# EAGLE design flossjtag (EAGLE 7.4.0)
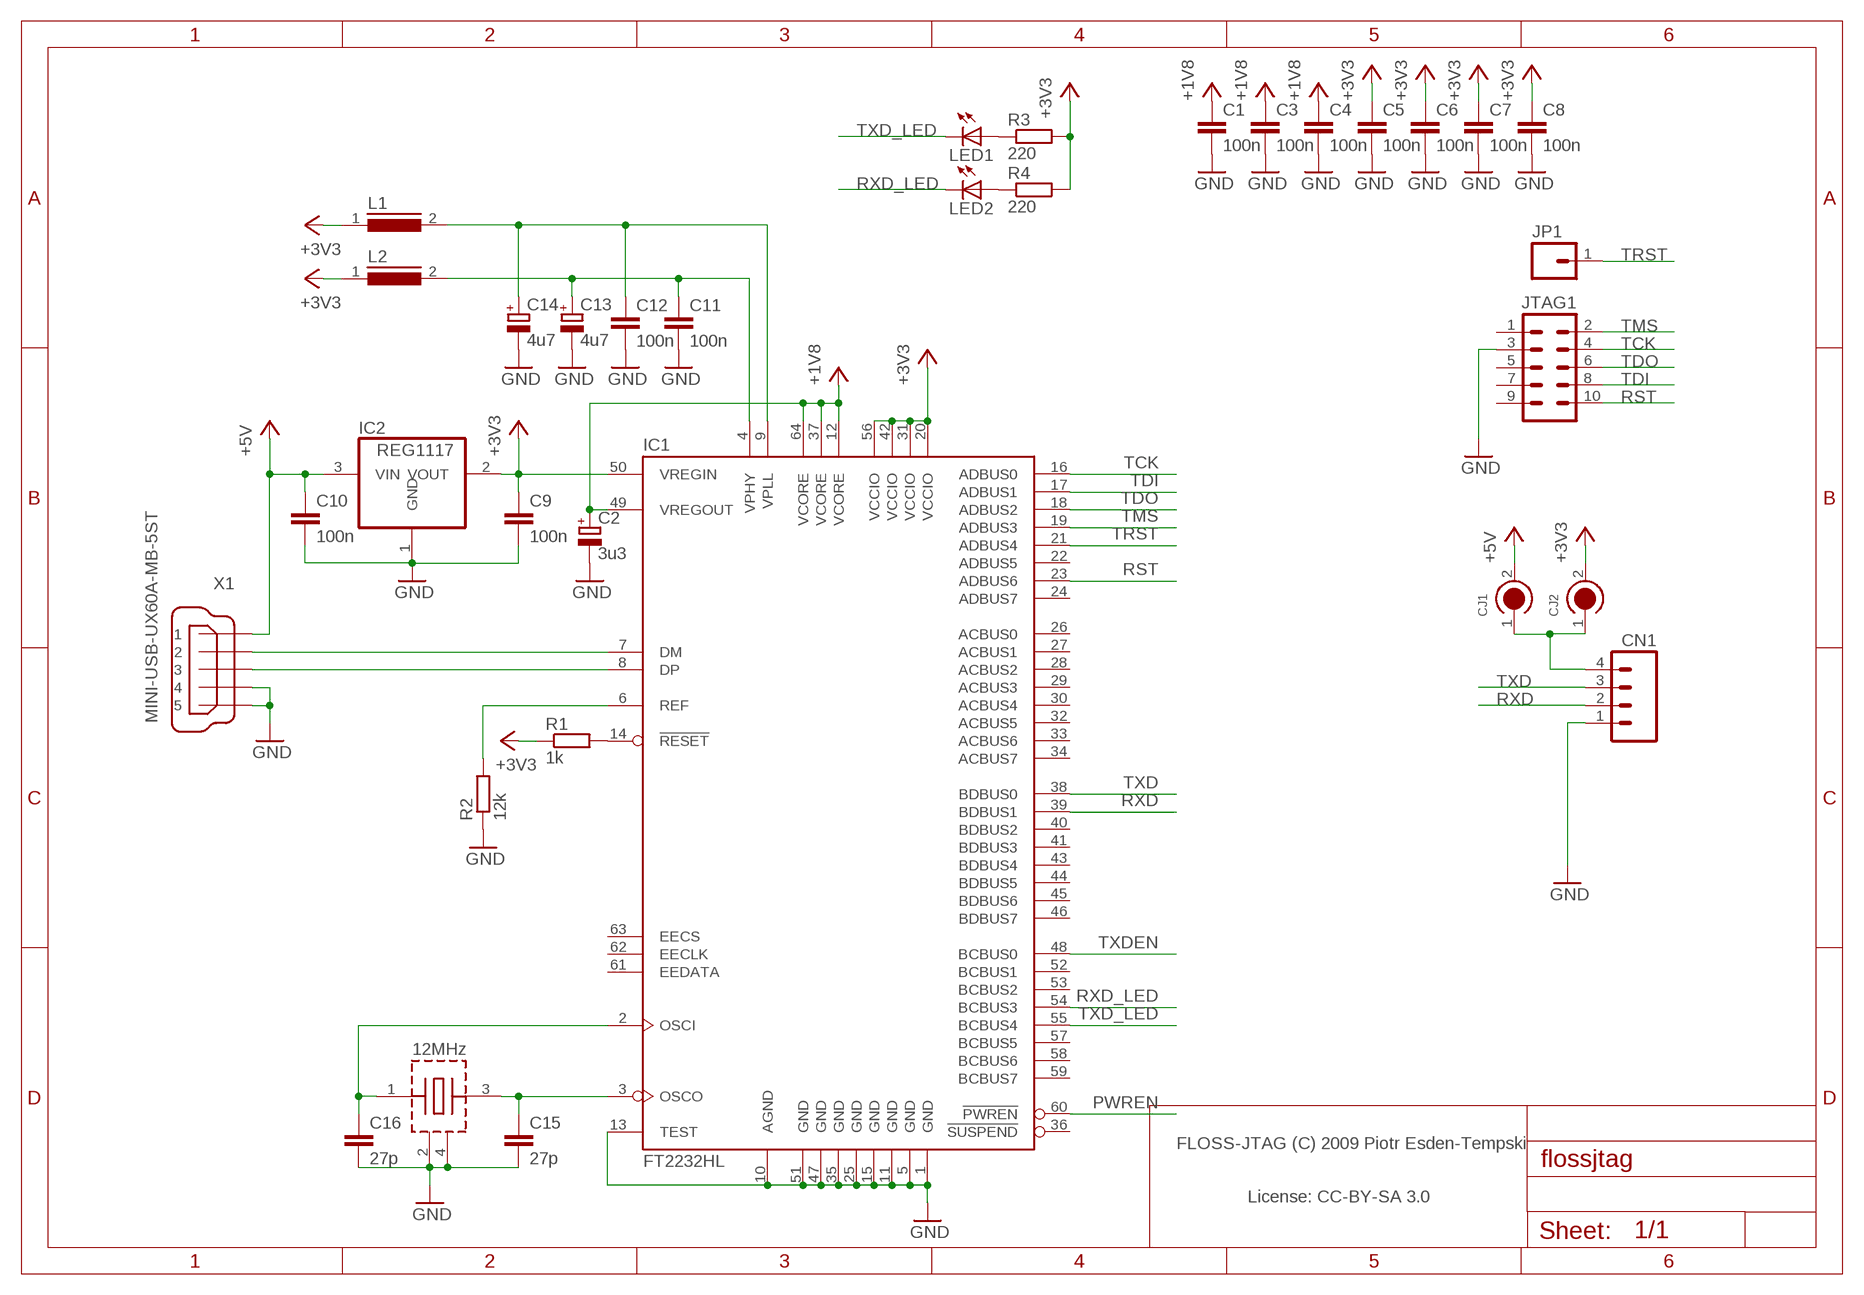
[diagram p0: schematic, sheet 1]

## Parts
C1  100n  C-EUC0603  [C0603]
C2  3u3  CPOL-EUA/3216-18R  [A/3216-18R]
C3  100n  C-EUC0603  [C0603]
C4  100n  C-EUC0603  [C0603]
C5  100n  C-EUC0603  [C0603]
C6  100n  C-EUC0603  [C0603]
C7  100n  C-EUC0603  [C0603]
C8  100n  C-EUC0603  [C0603]
C9  100n  C-EUC0603  [C0603]
C10  100n  C-EUC0603  [C0603]
C11  100n  C-EUC0603  [C0603]
C12  100n  C-EUC0603  [C0603]
C13  4u7  CPOL-EUA/3216-18R  [A/3216-18R]
C14  4u7  CPOL-EUA/3216-18R  [A/3216-18R]
C15  27p  C-EUC0603  [C0603]
C16  27p  C-EUC0603  [C0603]
CJ1  CIRC_JMP  [CIRC_JMP]
CJ2  CIRC_JMP  [CIRC_JMP]
CN1  SM04B-SRSS-TB  [SM04B-SRSS-TB]
IC1  FT2232HL  [LQFP64]
IC2  REG1117  [SOT223]
JP1  PAD-0.06  [PAD-0.06]
JTAG1  JTAG-EDGE  [JTAG-EDGE]
L1  I0603  [R0603]
L2  I0603  [R0603]
LED1  LEDCHIP-LED0603  [CHIP-LED0603]
LED2  LEDCHIP-LED0603  [CHIP-LED0603]
R1  1k  R-EU_R0603  [R0603]
R2  12k  R-EU_R0603  [R0603]
R3  220  R-EU_R0603  [R0603]
R4  220  R-EU_R0603  [R0603]
X1  MINI-USB-UX60A-MB-5ST  [UX60A-MB-5ST]
X3  12MHz  NX3225SA  [NX3225SA]

## Nets
+3V3: C5.1 C6.1 C7.1 C8.1 C9.1 CJ2.2 IC1.20(VCCIO) IC1.31(VCCIO) IC1.42(VCCIO) IC1.50(VREGIN) IC1.56(VCCIO) IC2.2(VOUT) L1.1 L2.1 R1.1 R3.2 R4.2
+5V: C10.1 CJ1.2 IC2.3(VIN) X1.1
GND: C1.2 C2.- C3.2 C4.2 C5.2 C6.2 C7.2 C8.2 C9.2 C10.2 C11.2 C12.2 C13.- C14.- C15.2 C16.2 CN1.1 IC1.1(GND) IC1.5(GND) IC1.10(AGND) IC1.11(GND) IC1.13(TEST) IC1.15(GND) IC1.25(GND) IC1.35(GND) IC1.47(GND) IC1.51(GND) IC2.1(GND) JTAG1.3 R2.1 X1.4 X1.5 X3.2(GND) X3.4(GND)
N$1: IC1.14(!RESET) R1.2
N$2: IC1.6(REF) R2.2
N$3: IC1.7(DM) X1.2
N$4: IC1.8(DP) X1.3
N$5: CJ1.1 CJ2.1 CN1.4
N$6: C16.1 IC1.2(OSCI) X3.1(XTAL)
N$7: C12.1 C14.+ IC1.9(VPLL) L1.2
N$8: C11.1 C13.+ IC1.4(VPHY) L2.2
N$9: C15.1 IC1.3(OSCO) X3.3(XTAL)
N$10: LED1.A R3.1
N$11: LED2.A R4.1
PWREN: IC1.60(!PWREN)
RST: IC1.23(ADBUS6) JTAG1.10
RXD: CN1.2 IC1.39(BDBUS1)
RXD_LED: IC1.54(BCBUS3) LED2.C
TCK: IC1.16(ADBUS0) JTAG1.4
TDI: IC1.17(ADBUS1) JTAG1.8
TDO: IC1.18(ADBUS2) JTAG1.6
TMS: IC1.19(ADBUS3) JTAG1.2
TRST: IC1.21(ADBUS4) JP1.1
TXD: CN1.3 IC1.38(BDBUS0)
TXD_LED: IC1.55(BCBUS4) LED1.C
TXDEN: IC1.48(BCBUS0)
VCC: C1.1 C2.+ C3.1 C4.1 IC1.12(VCORE) IC1.37(VCORE) IC1.49(VREGOUT) IC1.64(VCORE) ; supply symbol labelled +1V8
Unconnected: IC1.22(ADBUS5) IC1.24(ADBUS7) IC1.26(ACBUS0) IC1.27(ACBUS1) IC1.28(ACBUS2) IC1.29(ACBUS3) IC1.30(ACBUS4) IC1.32(ACBUS5) IC1.33(ACBUS6) IC1.34(ACBUS7) IC1.36(!SUSPEND) IC1.40(BDBUS2) IC1.41(BDBUS3) IC1.43(BDBUS4) IC1.44(BDBUS5) IC1.45(BDBUS6) IC1.46(BDBUS7) IC1.52(BCBUS1) IC1.53(BCBUS2) IC1.57(BCBUS5) IC1.58(BCBUS6) IC1.59(BCBUS7) IC1.61(EEDATA) IC1.62(EECLK) IC1.63(EECS) JTAG1.1 JTAG1.5 JTAG1.7 JTAG1.9

## Notes on the sheet
- FLOSS-JTAG (C) 2009 Piotr Esden-Tempski
- License: CC-BY-SA 3.0

## Library data of the parts
C1 C3-C12 C15 C16 = resistor:C-EU: CAPACITOR, European symbol
C2 C13 C14 = resistor:CPOL-EU: POLARIZED CAPACITOR, European symbol
CJ1 CJ2 = fancy_jumpers:CIRC_JMP
CN1 = zik:SM04B-SRSS-TB
IC1 = ftdi:FT2232HL
IC2 = burr-brown:REG1117: 800mA and 1A Low Dropout (LDO) Positive Regulator 1.8V, 2.5V, 2.85V, 3.3V, 5V, and Adj
JP1 = GUS Eng:PAD-
JTAG1 = OpenPilot:JTAG: Various JTAG connectors used on OpenPilot
L1 L2 = misc:I0603
LED1 LED2 = led:LED: LED OSRAM: - CHIPLED LG R971, LG N971, LY N971, LG Q971, LY Q971, LO R971, LY R971 LH N974, LH R974 LS Q976, LO Q976, LY Q976 LO Q996 - Hyper CHIPLED LW Q18S LB Q993, LB Q99A, LB R99A - SideLED LS A670, LO A670, LY A670, LG A670, LP A670 LB A673, LV A673, LT A673, LW A673 LH A674 LY A675 LS A676, LA A676, LO A676, LY A676, LW A676 LS A679, LY A679, LG A679 - Hyper Micro SIDELED® LS Y876, LA Y876, LO Y876, LY Y876 LT Y87S - SmartLED LW L88C, LW L88S LB L89C, LB L89S, LG L890 LS L89K, LO L89K, LY L89K LS L896, LA L896, LO L896, LY L896 - TOPLED LS T670, LO T670, LY T670, LG T670, LP T670 LSG T670, LSP T670, LSY T670, LOP T670, LYG T670 LG T671, LOG T671, LSG T671 LB T673, LV T673, LT T673, LW T673 LH T674 LS T676, LA T676, LO T676, LY T676, LB T676, LH T676, LSB T676, LW T676 LB T67C, LV T67C, LT T67C, LS T67K, LO T67K, LY T67K, LW E67C LS E67B, LA E67B, LO E67B, LY E67B, LB E67C, LV E67C, LT E67C LW T67C LS T679, LY T679, LG T679 LS T770, LO T770, LY T770, LG T770, LP T770 LB T773, LV T773, LT T773, LW T773 LH T774 LS E675, LA E675, LY E675, LS T675 LS T776, LA T776, LO T776, LY T776, LB T776 LHGB T686 LT T68C, LB T68C - Hyper Mini TOPLED® LB M676 - Mini TOPLED Santana® LG M470 LS M47K, LO M47K, LY M47K Source: http://www.osram.convergy.de LUXEON: - LUMILED® LXK2-PW12-R00, LXK2-PW12-S00, LXK2-PW14-U00, LXK2-PW14-V00 LXK2-PM12-R00, LXK2-PM12-S00, LXK2-PM14-U00 LXK2-PE12-Q00, LXK2-PE12-R00, LXK2-PE12-S00, LXK2-PE14-T00, LXK2-PE14-U00 LXK2-PB12-K00, LXK2-PB12-L00, LXK2-PB12-M00, LXK2-PB14-N00, LXK2-PB14-P00, LXK2-PB14-Q00 LXK2-PR12-L00, LXK2-PR12-M00, LXK2-PR14-Q00, LXK2-PR14-R00 LXK2-PD12-Q00, LXK2-PD12-R00, LXK2-PD12-S00 LXK2-PH12-R00, LXK2-PH12-S00 LXK2-PL12-P00, LXK2-PL12-Q00, LXK2-PL12-R00 Source: www.luxeon.com KINGBRIGHT: KA-3528ASYC Source: www.kingbright.com
R1-R4 = resistor:R-EU_: RESISTOR, European symbol
X1 = con-hirose:MINI-USB-: MINI USB Connector Source: http://www.hirose.co.jp/cataloge_hp/e24000019.pdf
X3 = misc:NX3225SA

## Board
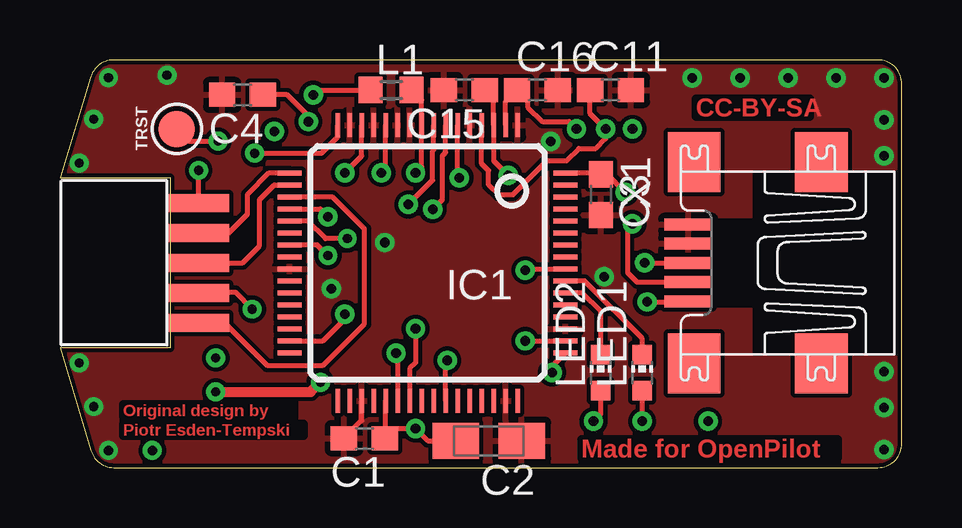
[diagram p1: board, top side]
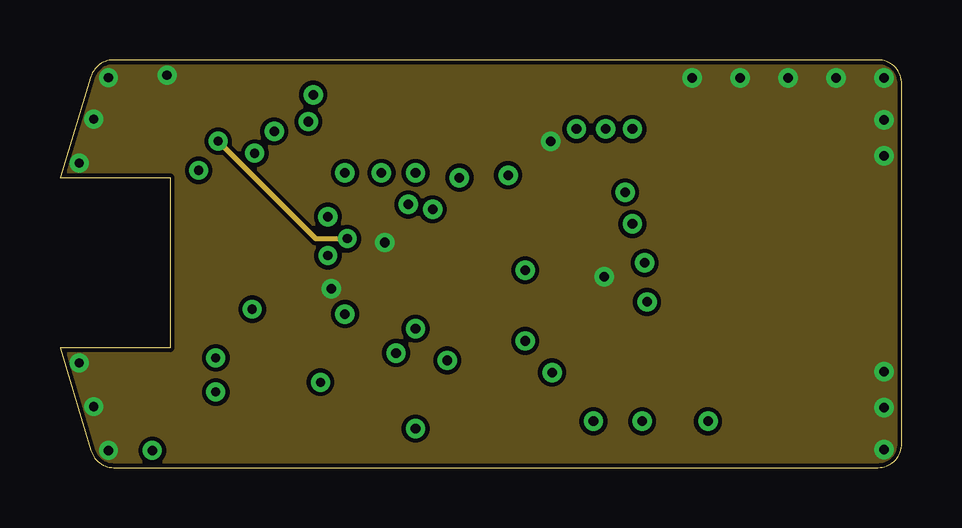
[diagram p2: board, inner layer Route2]
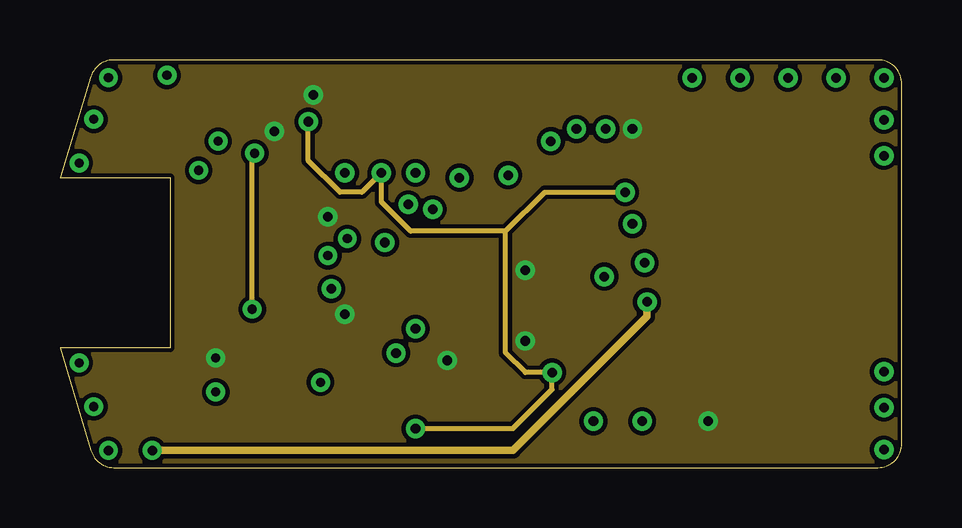
[diagram p3: board, inner layer Route15]
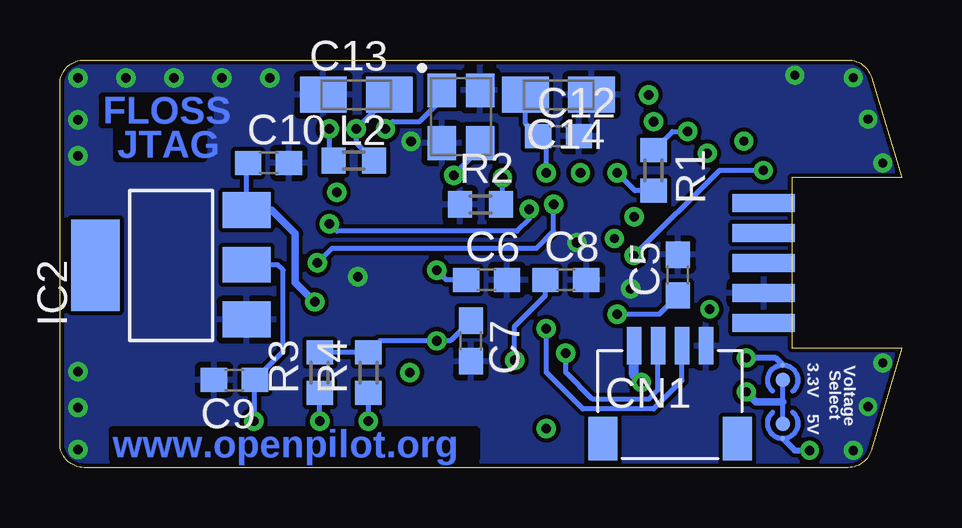
[diagram p4: board, bottom side, seen from below]

Size 35.1 x 17 mm. Coordinates in mm from the lower left corner, seen from the top.
Outline: 34.1,0 arc90 35.1,1 35.1,16 arc90 34.1,17 2.24,17 arc73 1.28,16.29 0,12.1 4.6,12.1 4.6,5 0,5 1.29,0.71 arc73 2.24,0 34.1,0
Copper layers (1*2+15*16): Top 0.0356mm / dielectric 1.5011mm / Route2 0.0356mm / dielectric 0.1499mm / Route15 0.0356mm / dielectric 0.2007mm / Bottom 0.0356mm
Design rules "7mils GUS Engineering (4 Layer)": minimum track width 7mil, minimum drill 15mil, track to track 7mil, track to pad 7mil, pad to pad 7mil, via to via 7mil, smd to smd 7mil, copper to edge 7mil, drill to drill 7mil, minimum pad ring 10mil, minimum via ring 8mil, stop-mask expansion 4mil, vias tented up to drill 25mil, thermal gap 10mil
tRestrict: area 14.2,14 to 14.4,14.5

### Footprints (pad centres in the part's own frame; a part is rotated, then mirrored left to right if it is on the bottom)
C0603 = smd 1.1 x 1: 1 -0.85,0; 2 0.85,0
A/3216-18R = smd 1.95 x 1.5: + 1.375,0; - -1.375,0
CIRC_JMP = smd 0.61 x 0.61: 1 0,0 | smd 0.203 x 0.203: 2 0,0.617
SM04B-SRSS-TB = smd 0.6 x 1.55: 1 3,0; 2 2,0; 3 1,0; 4 0,0 | smd 1.2 x 1.8: NC@1 -1.3,-3.875; NC@2 4.3,-3.875
LQFP64 = smd 0.2 x 1: 1 -3.75,-5.75; 2 -3.25,-5.75; 3 -2.75,-5.75; 4 -2.25,-5.75; 5 -1.75,-5.75; 6 -1.25,-5.75; 7 -0.75,-5.75; 8 -0.25,-5.75; 9 0.25,-5.75; 10 0.75,-5.75; 11 1.25,-5.75; 12 1.75,-5.75; 13 2.25,-5.75; 14 2.75,-5.75; 15 3.25,-5.75; 16 3.75,-5.75; 33 3.75,5.75; 34 3.25,5.75; 35 2.75,5.75; 36 2.25,5.75; 37 1.75,5.75; 38 1.25,5.75; 39 0.75,5.75; 40 0.25,5.75; 41 -0.25,5.75; 42 -0.75,5.75; 43 -1.25,5.75; 44 -1.75,5.75; 45 -2.25,5.75; 46 -2.75,5.75; 47 -3.25,5.75; 48 -3.75,5.75 | smd 1 x 0.2: 17 5.75,-3.75; 18 5.75,-3.25; 19 5.75,-2.75; 20 5.75,-2.25; 21 5.75,-1.75; 22 5.75,-1.25; 23 5.75,-0.75; 24 5.75,-0.25; 25 5.75,0.25; 26 5.75,0.75; 27 5.75,1.25; 28 5.75,1.75; 29 5.75,2.25; 30 5.75,2.75; 31 5.75,3.25; 32 5.75,3.75; 49 -5.75,3.75; 50 -5.75,3.25; 51 -5.75,2.75; 52 -5.75,2.25; 53 -5.75,1.75; 54 -5.75,1.25; 55 -5.75,0.75; 56 -5.75,0.25; 57 -5.75,-0.25; 58 -5.75,-0.75; 59 -5.75,-1.25; 60 -5.75,-1.75; 61 -5.75,-2.25; 62 -5.75,-2.75; 63 -5.75,-3.25; 64 -5.75,-3.75
SOT223 = smd 1.499 x 2.007: 1 -2.261,-3.15; 2 0.025,-3.15; 3 2.311,-3.15 | smd 3.81 x 2.007: 4 0,3.15
PAD-0.06 = smd 1.524 x 1.524: 1 0,0
JTAG-EDGE = smd 0.76 x 2.6 bottom: 1 -2.5,-1.3; 3 -1.25,-1.3; 5 0,-1.3; 7 1.25,-1.3; 9 2.5,-1.3 | smd 0.76 x 2.6: 2 -2.5,-1.3; 4 -1.25,-1.3; 6 0,-1.3; 8 1.25,-1.3; 10 2.5,-1.3
R0603 = smd 1 x 1.1: 1 -0.85,0; 2 0.85,0
CHIP-LED0603 = smd 0.8 x 0.8: A 0,-0.75; C 0,0.75
UX60A-MB-5ST = smd 2 x 0.5: 1 2.25,1.6; 2 2.25,0.8; 3 2.25,0; 4 2.25,-0.8; 5 2.25,-1.6 | smd 2.2 x 2.5: M1 -3.3,-4.2; M2 -3.3,4.2; M3 2,4.2; M4 2,-4.2
NX3225SA = smd 1.4 x 1.2: 1 -1.1,-0.8; 2 1.1,-0.8; 3 1.1,0.8; 4 -1.1,0.8

### Placement (x,y rotation side)
C1  12.69,1.22 180 top
C2  17.87,1.12 180 top
C3  22.55,11.38 270 top
C4  7.61,15.54 180 top
C5  9.34,8.03 90 bottom
C6  17.31,7.82 0 bottom
C7  17.97,5.28 270 bottom
C8  14.01,7.82 0 bottom
C9  27.83,3.66 180 bottom
C10  26.41,12.7 0 bottom
C11  22.95,15.75 0 top
C12  14.32,13.82 0 bottom
C13  22.75,15.54 0 bottom
C14  14.32,15.54 180 bottom
C15  16.86,15.75 180 top
C16  19.9,15.75 0 top
CJ1  4.97,1.83 180 bottom
CJ2  4.97,3.66 0 bottom
CN1  11.17,5.08 0 bottom
IC1  15.33,8.53 180 top
IC2  30.47,8.43 90 bottom
JP1  4.87,14.12 0 top
JTAG1  4.46,8.53 90 top
L1  13.81,15.75 0 top
L2  22.85,12.8 0 bottom
LED1  24.27,3.96 0 top
LED2  22.55,3.96 0 top
R1  10.35,12.4 270 bottom
R2  17.57,10.97 0 bottom
R3  24.27,3.96 90 bottom
R4  22.24,3.96 90 bottom
X1  28.44,8.53 180 top
X3  18.38,14.63 270 bottom

### Tracks (layer width: path | path; a pad name or v marks a point on that pad's centre or on a via)
+3V3  (via drill 0.38, 0.4)
  Top 0.203: v16.14,4.47 16.08,4.41 IC1.42 | IC1.50 v19.4,5.28 | IC1.31 10.96,5.28 11.88,6.2 v11.88,6.4 | v11.17,10.46 10.85,10.78 IC1.20 | v19.4,8.23 19.45,8.28 IC1.56 | v10.56,15.54 10.76,15.75 L1.1
  Bottom 0.203: 17.7,5.86 C7.1 18.82,5.28 v19.4,5.28 21.77,5.28 R4.2 R3.2 | C6.1 18.99,7.82 v19.4,8.23 | C8.1 14.86,7.18 16.14,5.89 v16.14,4.47 | R1.1 9.58,14.02 v8.93,14.02 | IC2.2 26.03,8.46 25.8,8.23 25.8,4.84 C9.1 26.98,1.97 v27.02,1.93 | L2.1 23.87,12.97 v23.87,14.12 | v11.88,6.4 10.11,6.4 C5.1
  Bottom 0.254: v6.49,4.57 5.27,4.57 CJ2.2
  pour Route15: -0.01,0 35.1,0 35.1,17 -0.01,17
+5V  (via drill 0.38, 0.4)
  Top 0.203: X1.1 26.16,6.91 v24.48,6.91
  Route15 0.305: v24.48,6.91 24.48,6.3 18.89,0.71 v3.85,0.71
  Bottom 0.203: C10.1 27.32,12.64 IC2.3
  Bottom 0.254: v3.85,0.71 4.47,0.71 CJ1.2
  Bottom 0.305: v24.48,6.91 25.29,7.72 25.29,9.75 26.28,10.74 IC2.3
GND  (via drill 0.38, 0.4)
  Top 0.203: C1.2 12.58,1.96 IC1.35
  Bottom 0.203: JTAG1.3 6.67,7.28
  other vias: 34.35,0.75 34.35,2.5 34.35,4 34.35,16.25 34.35,14.5 34.35,13 13.55,9.39 22.69,7.96 20.47,13.61 32.35,16.25 30.35,16.25 28.35,16.25 26.35,16.25 11.31,7.46 0.8,4.37 2.02,0.71 1.41,2.54 0.8,12.7 2.02,16.26 1.41,14.53 4.46,16.36
  pour Route2: -0.01,0 35.1,0 35.1,17 -0.01,17
  pour Top: -0.01,0 35.1,0 35.1,17 -0.01,17
  pour Bottom: -0.01,0 35.1,0 35.1,17 -0.01,17
N$1  (via drill 0.4)
  Top 0.203: IC1.14 12.58,13 v11.88,12.29
  Bottom 0.203: R1.2 11.13,11.54 v11.88,12.29
N$2  (via drill 0.4)
  Top 0.203: IC1.6 16.58,12.16 v16.65,12.09
  Bottom 0.203: R2.2 16.65,11.04 v16.65,12.09
N$3  (via drill 0.4)
  Top 0.203: v15.54,10.77 15.94,11.18 15.94,13.01 16.08,13.14 IC1.7 | v23.87,10.16 23.66,9.96 23.66,8.13 24.06,7.73 X1.2
  Bottom 0.203: v15.54,10.77 15.54,10.36 16.04,9.86 23.56,9.86 v23.87,10.16
N$4  (via drill 0.4)
  Top 0.203: v14.52,10.97 15.54,11.99 15.54,13.21 15.58,13.26 IC1.8 | v24.37,8.53 X1.3
  Bottom 0.203: v14.52,10.97 14.52,9.86 15.23,9.14 23.77,9.14 v24.37,8.53
N$5  (via drill 0.38)
  Top 0.406: v10.86,3.56 10.46,3.15 v6.49,3.15
  Bottom 0.203: CJ1.1 4.97,2.74 CJ2.1
  Bottom 0.305: v6.49,3.15 6.09,2.74 4.97,2.74
  Bottom 0.406: v10.86,3.56 11.17,3.86 CN1.4
N$6  (via drill 0.4)
  Top 0.203: v21.53,14.12 21.23,14.43 20.11,14.43 19.5,15.04 19.5,15.14 19.5,15.3 C16.1 18.58,15.28 IC1.2
  Bottom 0.203: X3.1 19.18,15.35 20.11,14.43 21.23,14.43 v21.53,14.12
N$7  (via drill 0.4)
  Top 0.203: v14.82,12.29 15.08,12.55 IC1.9 15.08,15.32 L1.2
  Bottom 0.203: v14.82,12.29 14.82,13.53 15.12,13.82 C12.1 15.69,14.34 C14.+
N$8  (via drill 0.4)
  Top 0.203: C11.1 22.1,14.77 v22.75,14.12 22.75,13.72 22.34,13.31 21.63,13.31 21.12,12.8 20.31,12.8 18.89,11.38 18.28,11.38 17.87,11.79 17.87,12.39 17.58,12.69 IC1.4
  Bottom 0.203: L2.2 22.75,13.55 v22.75,14.12 21.37,15.5 C13.+
N$9  (via drill 0.4)
  Top 0.203: v18.69,12.19 18.08,12.79 IC1.3 18.08,15.37 C15.1
  Bottom 0.203: X3.3 17.58,13.3 v18.69,12.19
N$10  (via drill 0.4)
  Top 0.203: v24.27,1.93 LED1.A
  Bottom 0.203: v24.27,1.93 R3.1
N$11  (via drill 0.4)
  Top 0.203: v22.24,1.93 22.55,2.23 LED2.A
  Bottom 0.203: 22.24,3.21 R4.1 v22.24,1.93
RST  (via drill 0.38)
  Top 0.203: IC1.23 10.72,9.28 v11.17,8.84 | JTAG1.10 5.8,11.26 5.78,11.28 v5.78,12.39
  Bottom 0.203: v5.78,12.39 7.61,12.39 v11.17,8.84
RXD  (via drill 0.4)
  Top 0.203: v14.82,5.79 14.82,4.37 14.58,4.13 IC1.39
  Bottom 0.203: CN1.2 9.17,3.63 10.35,2.44 13.3,2.44 14.82,3.96 v14.82,5.79
RXD_LED
  Top 0.203: LED2.C 22.55,6.5 21.76,7.28 IC1.54
TCK  (via drill 0.38)
  Top 0.203: IC1.16 11.58,13.78 10.9,13.11 v8.12,13.11 | JTAG1.4 6.36,7.28 6.39,7.32 7.31,7.32 v8.02,6.6
  Route15 0.203: v8.02,6.6 8.02,13.01 v8.12,13.11
TDI
  Top 0.203: JTAG1.8 7.03,9.78 7.81,10.57 7.81,11.38 8.73,12.29 9.57,12.29 IC1.17
TDO
  Top 0.203: JTAG1.6 7.61,8.53 8.32,9.25 8.32,11.18 8.93,11.79 IC1.18
TMS
  Top 0.203: JTAG1.2 6.86,6.03 8.63,4.27 10.96,4.27 12.69,5.99 12.69,9.96 11.37,11.28 IC1.19
TRST  (via drill 0.38)
  Top 0.203: IC1.21 10.33,10.28 11.06,9.55 v11.98,9.55 | v6.59,13.61 5.38,13.61 JP1.1
  Route2 0.203: v6.59,13.61 10.66,9.55 v11.98,9.55
TXD  (via drill 0.4)
  Top 0.203: v14.01,4.78 14.08,4.7 IC1.38
  Bottom 0.203: CN1.3 10.17,3.23 10.56,2.85 12.89,2.85 14.01,3.96 v14.01,4.78
TXD_LED
  Top 0.203: LED1.C 24.27,5.08 24.27,5.38 21.94,7.72 21.87,7.78 IC1.55
VCC  (via drill 0.4)
  Top 0.203: v10.35,14.43 10.35,14.67 9.48,15.54 C4.1 | C1.1 13.58,1.26 | 13.58,1.26 IC1.37 | 13.58,1.26 13.61,1.28 13.61,1.32 13.91,1.63 v14.82,1.63 15.33,1.12 C2.+ | IC1.49 20.51,4.22 v20.51,3.96 | v23.56,11.48 22.81,12.23 C3.1 22.49,12.28 IC1.64 | IC1.12 13.58,12.47 v13.4,12.29
  Route15 0.203: v10.35,14.43 10.35,12.8 11.67,11.48 12.59,11.48 v13.4,12.29 13.4,11.07 14.62,9.86 18.58,9.86 | v23.56,11.48 20.21,11.48 18.58,9.86 | 18.58,9.86 18.58,4.78 19.4,3.96 v20.51,3.96 20.51,3.25 18.89,1.63 v14.82,1.63

### Text on the board
Top: CC-BY-SA | Original design by | Piotr Esden-Tempski | Made for OpenPilot
Bottom: FLOSS | JTAG | www.openpilot.org
tStop: CC-BY-SA | Original design by | Piotr Esden-Tempski | Made for OpenPilot
bStop: FLOSS | JTAG | www.openpilot.org
_tsilk: TRST
_bsilk: Voltage | Select | 3.3V | 5V